# Altium schematic sheet 01_MCU.SchDoc
size A4
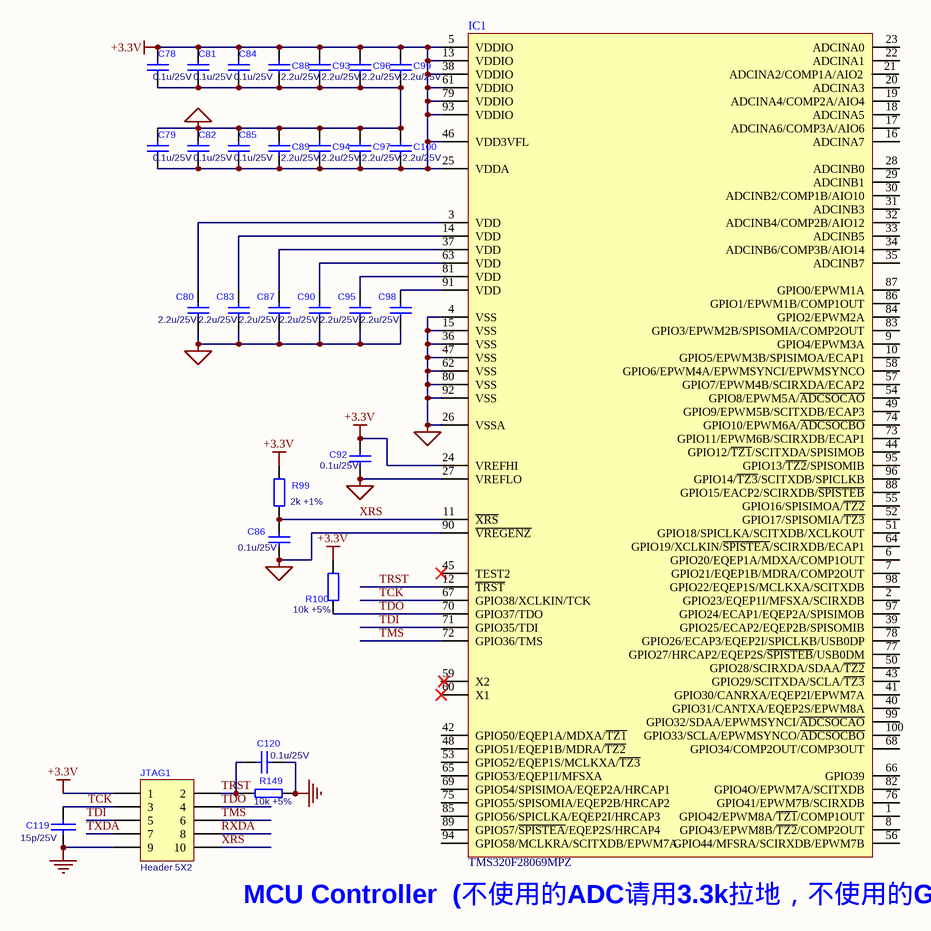
[diagram p0: 01_MCU.SchDoc]

## Parts
C78  0.1u/25V  [C0603]
C79  0.1u/25V  [R0603]
C80  2.2u/25V  [R0603]
C81  0.1u/25V  [C0603]
C82  0.1u/25V  [R0603]
C83  2.2u/25V  [R0603]
C84  0.1u/25V  [R0603]
C85  0.1u/25V  [R0603]
C86  0.1u/25V  [R0603]
C87  2.2u/25V  [R0603]
C88  2.2u/25V  [R0603]
C89  2.2u/25V  [R0603]
C90  2.2u/25V  [R0603]
C92  0.1u/25V  [R0603]
C93  2.2u/25V  [R0603]
C94  2.2u/25V  [R0603]
C95  2.2u/25V  [R0603]
C96  2.2u/25V  [R0603]
C97  2.2u/25V  [R0603]
C98  2.2u/25V  [R0603]
C99  2.2u/25V  [R0603]
C100  2.2u/25V  [R0603]
C119  15p/25V  [R0603]
C120  0.1u/25V  [R0603]
IC1  TMS320F28069MPZ  [RX62T]
JTAG1  Header 5X2  [PZ-2*5-M-SI]
R99  2k +1%  [R0603]
R100  10k +5%  [R0603]
R149  10k +5%  [R0603]

## Nets
+3.3V: C78.1 C79.2 C81.1 C82.2 C84.1 C85.2 C88.1 C89.2 C92.1 C93.1 C94.2 C96.1 C97.2 C99.1 C100.2 IC1.5(VDDIO) IC1.13(VDDIO) IC1.24(VREFHI) IC1.25(VDDA) IC1.38(VDDIO) IC1.46(VDD3VFL) IC1.61(VDDIO) IC1.79(VDDIO) IC1.93(VDDIO) JTAG1.1 R99.2 R100.2
GND: C78.2 C79.1 C80.2 C81.2 C82.1 C83.2 C84.2 C85.1 C86.2 C87.2 C88.2 C89.1 C90.2 C92.2 C93.2 C94.1 C95.2 C96.2 C97.1 C98.2 C99.2 C100.1 C119.2 C120.1 IC1.4(VSS) IC1.15(VSS) IC1.26(VSSA) IC1.27(VREFLO) IC1.36(VSS) IC1.47(VSS) IC1.62(VSS) IC1.80(VSS) IC1.90(~{VREGENZ}) IC1.92(VSS) JTAG1.9 R149.2
RXDA: JTAG1.8
TCK: C119.1 IC1.67(GPIO38/XCLKIN/TCK) JTAG1.3
TDI: IC1.71(GPIO35/TDI) JTAG1.5
TDO: IC1.70(GPIO37/TDO) JTAG1.4 R100.1
TMS: IC1.72(GPIO36/TMS) JTAG1.6
TRST: C120.2 IC1.12(~{TRST}) JTAG1.2 R149.1
TXDA: JTAG1.7
XRS: C86.1 IC1.11(~{XRS}) JTAG1.10 R99.1
NetC80_1: C80.1 IC1.3(VDD)
NetC83_1: C83.1 IC1.14(VDD)
NetC87_1: C87.1 IC1.37(VDD)
NetC90_1: C90.1 IC1.63(VDD)
NetC95_1: C95.1 IC1.81(VDD)
NetC98_1: C98.1 IC1.91(VDD)

Not connected (* = marked no-connect by the designer): IC1 1(GPIO42/EPWM8A/~{TZ1}/COMP1OUT) 2(GPIO23/EQEP1I/MFSXA/SCIRXDB) 6(GPIO20/EQEP1A/MDXA/COMP1OUT) 7(GPIO21/EQEP1B/MDRA/COMP2OUT) 8(GPIO43/EPWM8B/~{TZ2}/COMP2OUT) 9(GPIO4/EPWM3A) 10(GPIO5/EPWM3B/SPISIMOA/ECAP1) 16(ADCINA7) 17(ADCINA6/COMP3A/AIO6) 18(ADCINA5) 19(ADCINA4/COMP2A/AIO4) 20(ADCINA3) 21(ADCINA2/COMP1A/AIO2) 22(ADCINA1) 23(ADCINA0) 28(ADCINB0) 29(ADCINB1) 30(ADCINB2/COMP1B/AIO10) 31(ADCINB3) 32(ADCINB4/COMP2B/AIO12) 33(ADCINB5) 34(ADCINB6/COMP3B/AIO14) 35(ADCINB7) 39(GPIO25/ECAP2/EQEP2B/SPISOMIB) 40(GPIO31/CANTXA/EQEP2S/EPWM8A) 41(GPIO30/CANRXA/EQEP2I/EPWM7A) 42(GPIO50/EQEP1A/MDXA/~{TZ1}) 43(GPIO29/SCITXDA/SCLA/~{TZ3}) 44(GPIO12/~{TZ1}/SCITXDA/SPISIMOB) 45(TEST2)* 48(GPIO51/EQEP1B/MDRA/~{TZ2}) 49(GPIO9/EPWM5B/SCITXDB/ECAP3) 50(GPIO28/SCIRXDA/SDAA/~{TZ2}) 51(GPIO18/SPICLKA/SCITXDB/XCLKOUT) 52(GPIO17/SPISOMIA/~{TZ3}) 53(GPIO52/EQEP1S/MCLKXA/~{TZ3}) 54(GPIO8/EPWM5A/~{ADCSOCAO}) 55(GPIO16/SPISIMOA/~{TZ2}) 56(GPIO44/MFSRA/SCIRXDB/EPWM7B) 57(GPIO7/EPWM4B/SCIRXDA/ECAP2) 58(GPIO6/EPWM4A/EPWMSYNCI/EPWMSYNCO) 59(X2) 60(X1)* 64(GPIO19/XCLKIN/~{SPISTEA}/SCIRXDB/ECAP1) 65(GPIO53/EQEP1I/MFSXA) 66(GPIO39) 68(GPIO34/COMP2OUT/COMP3OUT) 69(GPIO54/SPISIMOA/EQEP2A/HRCAP1) 73(GPIO11/EPWM6B/SCIRXDB/ECAP1) 74(GPIO10/EPWM6A/~{ADCSOCBO}) 75(GPIO55/SPISOMIA/EQEP2B/HRCAP2) 76(GPIO41/EPWM7B/SCIRXDB) 77(GPIO27/HRCAP2/EQEP2S/~{SPISTEB}/USB0DM) 78(GPIO26/ECAP3/EQEP2I/SPICLKB/USB0DP) 82(GPIO4O/EPWM7A/SCITXDB) 83(GPIO3/EPWM2B/SPISOMIA/COMP2OUT) 84(GPIO2/EPWM2A) 85(GPIO56/SPICLKA/EQEP2I/HRCAP3) 86(GPIO1/EPWM1B/COMP1OUT) 87(GPIO0/EPWM1A) 88(GPIO15/EACP2/SCIRXDB/~{SPISTEB}) 89(GPIO57/~{SPISTEA}/EQEP2S/HRCAP4) 94(GPIO58/MCLKRA/SCITXDB/EPWM7A) 95(GPIO13/~{TZ2}/SPISOMIB) 96(GPIO14/~{TZ3}/SCITXDB/SPICLKB) 97(GPIO24/ECAP1/EQEP2A/SPISIMOB) 98(GPIO22/EQEP1S/MCLKXA/SCITXDB) 99(GPIO32/SDAA/EPWMSYNCI/~{ADCSOCAO}) 100(GPIO33/SCLA/EPWMSYNCO/~{ADCSOCBO})

## Notes on the sheet
- (near IC1) fsw=45KHz
- MCU Controller  (不使用的ADC请用3.3k拉地，不使用的GPIO请悬空)

## Library data of the parts
C78-C90 C92-C100 C120 = Cap: Capacitor; Value: 100pF; Published: 8-Jun-2000; LatestRevisionDate: 17-Jul-2002; LatestRevisionNote: Re-released for DXP Platform.; PackageReference: RAD-0.3; Publisher: Altium Limited
C119 = CAP: Capacitor
IC1 = IC-TMS320F28062: TI MCU_TMS320F28069
JTAG1 = Header 5X2: Header, 5-Pin, Dual row; Manufacturer: Generic Components; Class I: Connector; Revision: July-2002: Re-released for DXP Platform.; Publisher: Altium Limited
R99 = Res2: Resistor; Value: 1K; Published: 8-Jun-2000; LatestRevisionDate: 17-Jul-2002; LatestRevisionNote: Re-released for DXP Platform.; PackageReference: AXIAL-0.4; Publisher: Altium Limited
R100 = Res2: Resistor; Published: 8-Jun-2000; LatestRevisionDate: 17-Jul-2002; LatestRevisionNote: Re-released for DXP Platform.; PackageReference: AXIAL-0.4; Publisher: Altium Limited
R149 = RES/0603: Comment_1: 0603; Value: 10K